# Altium schematic sheet Driver.SchDoc
size A; SheetNumber: 3; SheetTotal: 3
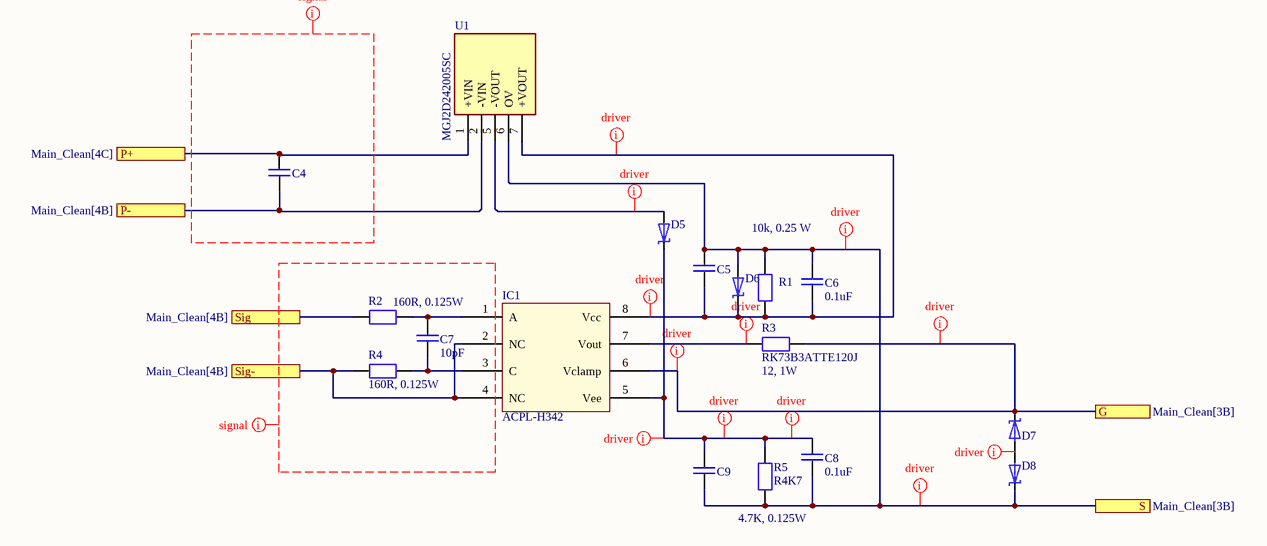
[diagram p0: Driver.SchDoc]

## Parts
C4  Cer_large  [CAPC3227X25N]  (value not drawn)
C5  Cer_large  [CAPC3227X25N]  (value not drawn)
C6  value 0.1uF  [C_0805]  (hidden comment: C0805C104K5RAC)
C7  value 10pF  [C_0805]  (hidden comment: C0805C100J1GAC)
C8  value 0.1uF  [C_0805]  (hidden comment: C0805C104K5RAC)
C9  Cer_large  [CAPC3227X25N]  (value not drawn)
D5  Zener_1.8V  [SOD123]  (value not drawn)
D6  DZ2J220M0L  [SOD323F]  (value not drawn)
D7  MMSZ4678T1G  [CAPM3216X18N]  (value not drawn)
D8  MMSZ4678T1G  [CAPM3216X18N]  (value not drawn)
IC1  ACPL-H342  [SOIC127P970X330-8N]
R1  value 10k, 0.25 W  [SMD_1206]  (hidden comment: RK73H2BTTD1002F)
R2  value 160R, 0.125W  [SMD_0805]  (hidden comment: RK73H2ATTD1600F)
R3  RK73B3ATTE120J  value 12, 1W  [SMD_2512]
R4  value 160R, 0.125W  [SMD_0805]  (hidden comment: RK73H2ATTD1600F)
R5  R4K7  value 4.7K, 0.125W  [smd_0603]
U1  MGJ2D242005SC  [MURATA-MGJ2]

## Ports
G (see Main_Clean[3B]), P+ (see Main_Clean[4C]), P- (see Main_Clean[4B]), S (see Main_Clean[3B]), Sig (see Main_Clean[4B]), Sig- (see Main_Clean[4B])

## Nets
G: D7.1 IC1.6(Vclamp) R3.2 ; port G
P+: C4.1 U1.1(+VIN) ; port P+
P-: C4.2 U1.2(-VIN) ; port P-
S: C5.1 C6.1 C8.2 C9.2 D6.1 D8.1 R1.2 R5.1 U1.6(OV) ; port S
Sig: R2.1 ; port Sig
Sig-: IC1.2(NC) IC1.4(NC) R4.1 ; port Sig-
NetC5_2: C5.2 C6.2 D6.2 IC1.8(Vcc) R1.1 U1.7(+VOUT)
NetC7_1: C7.1 IC1.1(A) R2.2
NetC7_2: C7.2 IC1.3(C) R4.2
NetC8_1: C8.1 C9.1 D5.2 IC1.5(Vee) R5.2
NetD5_1: D5.1 U1.5(-VOUT)
NetD7_2: D7.2 D8.2
NetIC1_7: IC1.7(Vout) R3.1

## Layout directives
net class Driver: G, NetC5_2, NetC8_1, NetD5_1, NetD7_2, NetIC1_7, S
net class Signal: (no net found under the mark)

## Library data of the parts
C4 C5 C9 = Cer_large: Order code: 1759466; Value: 22mkF; Type: 16V; Supplier: Farnel; Price: 0.407; Package: 1210
C6 C8 = C0805C104K5RAC: 0.1u, 50V; Manufacturer: Kemet; Order code: 6576631; Supplier: Elfa; Price: 0,06; Type: C0805C104K5RAC; Package: smd 0805
C7 = C0805C100J1GAC: 10p, 100V; Manufacturer: Kemet; Order code: 6576805; Supplier: Elfa; Price: 0,266; Type: C0805C100J1GAC; Package: smd 0805
D5 = Zener_1.8V: Zener diode; Type: 0.5W; Value: 1.8V; Order code: 1459115; Supplier: Farnell; Price: 0.172; Package: SOD-123
D6 = DZ2J220M0L: Type: Zener diode; Value: 22V, 200mW; Order code: 2285315; Package: SOD323F; Supplier: Farnel; Price: 0.041
D7 D8 = Zener_MMSZ5233BT1G: 6V, 500mW, Zener Diodes; Manufacturer: ON Semiconductor; Order code: 863-MMSZ5233BT1G; Supplier: Mouser; Price: 0,18; Package: SOD-123-2; Type: Zener Diodes; PartNumber: MMSZ5233BT1G; Value: 6V, 500mW
IC1 = ACPL-H342: Manufacturer: Avago; Order code: 1833408; Value: 2,5 A, 12-30V; Package: SSO-8; Price: 2; Publisher: *; Supplier: Farnell; Type: ACPL-H342
R1 = RK73H2BTTD1002F: 10k, 0.25 W; Manufacturer: KOA; Order code: 6019731; Price: 0,111; Supplier: Elfa; datasheet: https://www1.elfa.se/data1/wwwroot/assets/datasheets/06016752.pdf; Type: RK73H2BTTD1002F; Package: smd 1206
R2 R4 = RK73H2ATTD1600F: 160R, 0.125W; Manufacturer: KOA; Order code: 60-173-05; Type: 1%, 150V; Price: 0.097; Package: smd 0805; Supplier: Elfa
R3 = RK73B3ATTE120J: Manufacturer: KOA; Order code: 60-205-98; Type: 200V, 5%; Supplier: Elfa; Price: 0,144; Package: smd 2512
R5 = R4K7: Order code: 9332154; Type: 16V, 1%; Package: smd 0603; Manufacturer: *; Supplier: Farnel; Price: 0.01
U1 = MGJ2D242005SC: Undefined or Miscellaneous; Manufacturer_Name: Murata Electronics; Datasheet Link: http://power.murata.com/data/power/ncl/kdc_mgj2.pdf; Manufacturer_Part_Number: MGJ2D242005SC; Mouser Part Number: 580-MGJ2D242005SC; Mouser Price/Stock: https://www.mouser.co.uk/ProductDetail/Murata-Power-Solutions/MGJ2D242005SC?qs=xLDY6iXSiQZFsrjCzeaXXw%3D%3D; Arrow Part Number: MGJ2D242005SC; Arrow Price/Stock: https://www.arrow.com/en/products/mgj2d242005sc/murata-power-solutions?region=nac